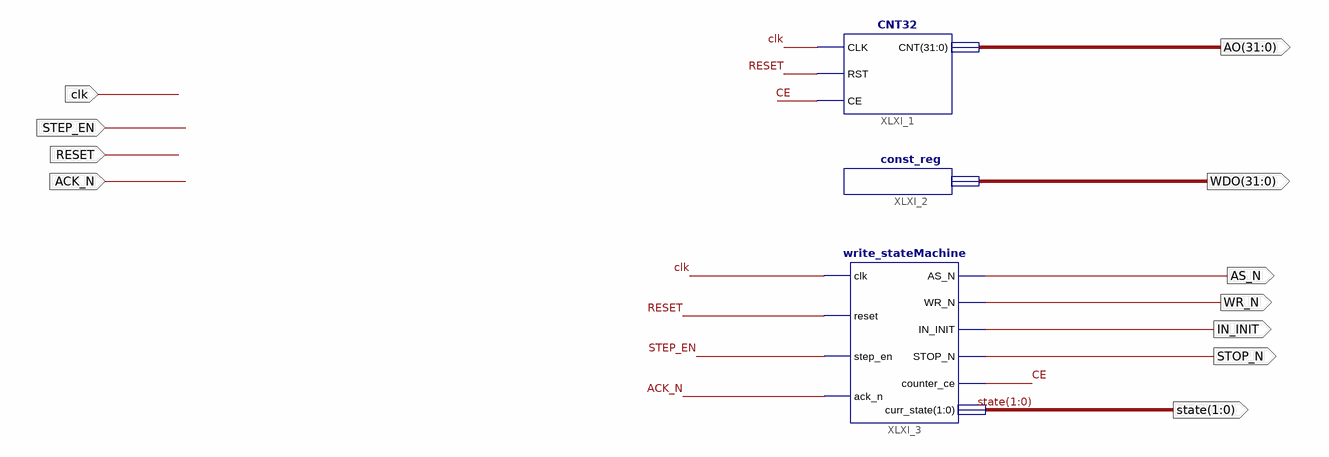
[diagram p0: schematic sheet 1]
// Xilinx ISE schematic write_machine.sch (artix7) as structural Verilog: 3 symbols, 11 ports
module write_machine (
  input  clk,
  input  RESET,
  input  STEP_EN,
  input  ACK_N,
  output [31:0] AO,
  output [31:0] WDO,
  output IN_INIT,
  output AS_N,
  output STOP_N,
  output WR_N,
  output [1:0] state
);

  wire CE;

  CNT32 XLXI_1 (.CLK(clk), .RST(RESET), .CE(CE), .CNT(AO));
  const_reg XLXI_2 (.ID(WDO));
  write_stateMachine XLXI_3 (
    .clk(clk), .reset(RESET), .step_en(STEP_EN), .ack_n(ACK_N), .AS_N(AS_N), .WR_N(WR_N), .IN_INIT(IN_INIT),
    .STOP_N(STOP_N), .counter_ce(CE), .curr_state(state));
endmodule
